# EAGLE design 1st_layer (EAGLE 9.6.2)
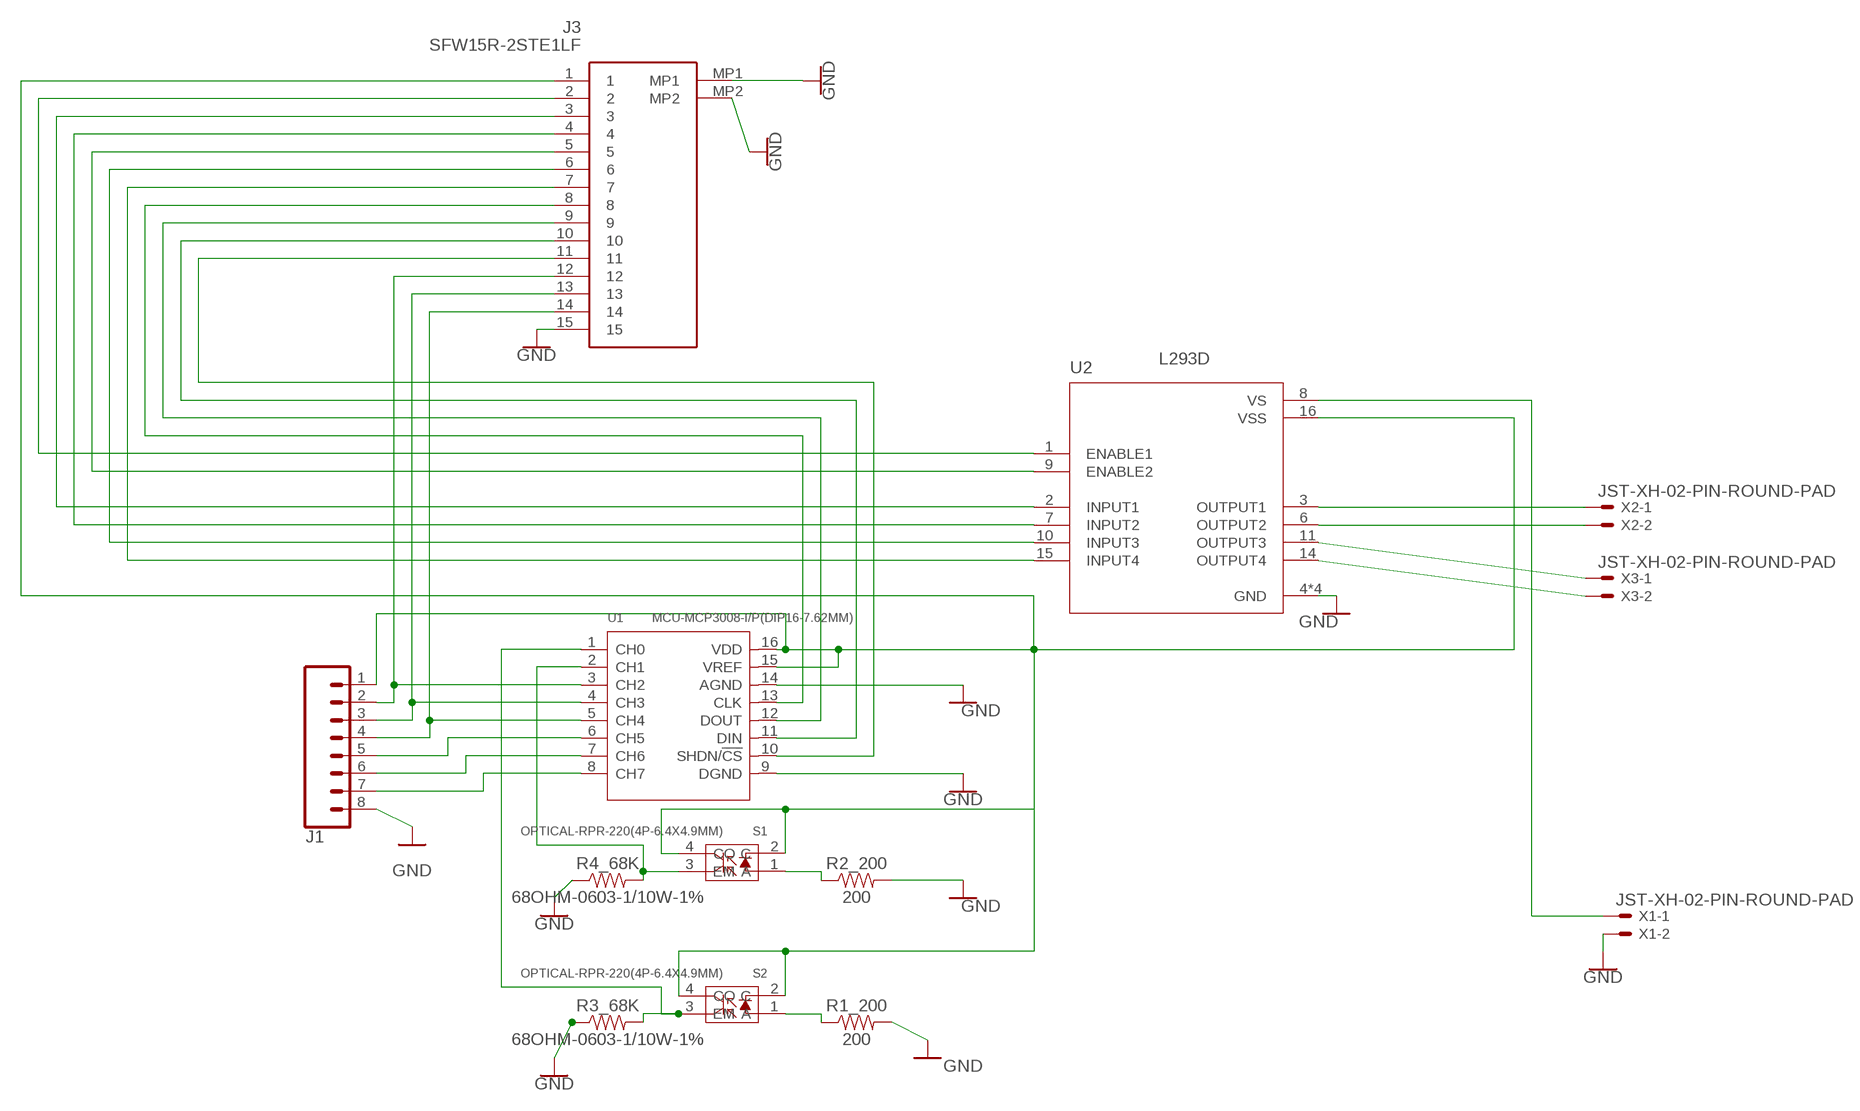
[diagram p0: schematic, sheet 1]

## Parts
J1  CONN_08LONGPADS  [1X08_LONGPADS]
J3  SFW15R-2STE1LF  [SFW15R2STE1LF]
R1_200  200  200OHM-0603-1/10W-1%  [0603]
R2_200  200  200OHM-0603-1/10W-1%  [0603]
R3_68K  68OHM-0603-1/10W-1%  [0603]
R4_68K  68OHM-0603-1/10W-1%  [0603]
S1  OPTICAL-RPR-220(4P-6.4X4.9MM)  [SNR4-8.7X4.5X5.8MM]
S2  OPTICAL-RPR-220(4P-6.4X4.9MM)  [SNR4-8.7X4.5X5.8MM]
U1  MCU-MCP3008-I/P(DIP16-7.62MM)  [DIP16-2.54-19.2X7.62MM]
U2  L293D  [DIP880W50P254L2000H510Q16]
X1  JST-XH-02-PIN-ROUND-PAD  [JST-XH-02-PACKAGE-ROUND-PAD]
X2  JST-XH-02-PIN-ROUND-PAD  [JST-XH-02-PACKAGE-ROUND-PAD]
X3  JST-XH-02-PIN-ROUND-PAD  [JST-XH-02-PACKAGE-ROUND-PAD]

## Nets
GND: J1.8 J3.15 J3.MP1 J3.MP2 R1_200.2 R2_200.2 R3_68K.1 R4_68K.1 U1.9(DGND) U1.14(AGND) U2.4(GND) U2.5(GND) U2.12(GND) U2.13(GND) X1.2
N$1: R2_200.1 S1.1(A)
N$2: R1_200.1 S2.1(A)
N$3: U2.8(VS) X1.1
N$4: R4_68K.2 S1.3(EM) U1.2(CH1)
N$6: R3_68K.2 S2.3(EM) U1.1(CH0)
N$7: U2.3(OUTPUT1) X2.1
N$8: U2.6(OUTPUT2) X2.2
N$9: U2.11(OUTPUT3) X3.1
N$10: U2.14(OUTPUT4) X3.2
N$11: J1.2 J3.12 U1.3(CH2)
N$12: J3.3 U2.2(INPUT1)
N$13: J3.4 U2.7(INPUT2)
N$14: J3.5 U2.9(ENABLE2)
N$15: J3.2 U2.1(ENABLE1)
N$16: J3.6 U2.10(INPUT3)
N$17: J3.7 U2.15(INPUT4)
N$18: J3.8 U1.13(CLK)
N$19: J3.9 U1.12(DOUT)
N$20: J3.10 U1.11(DIN)
N$21: J3.11 U1.10(SHDN/!CS)
N$22: J1.3 J3.13 U1.4(CH3)
N$23: J1.4 J3.14 U1.5(CH4)
N$24: J1.5 U1.6(CH5)
N$25: J1.6 U1.7(CH6)
N$26: J1.7 U1.8(CH7)
VDD: J1.1 J3.1 S1.2(C) S1.4(CO) S2.2(C) S2.4(CO) U1.15(VREF) U1.16(VDD) U2.16(VSS)

## Library data of the parts
J1 = SparkFun-Connectors:CONN_08: Multi connection point. Often used as Generic Header-pin footprint for 0.1 inch spaced/style header connections On any of the 0.1 inch spaced packages, you can populate with these: Break Away Headers - Straight <https://www.sparkfun.com/products/116> (PRT-00116) Break Away Male Headers - Right Angle <https://www.sparkfun.com/products/553> (PRT-00553) Female Headers <https://www.sparkfun.com/products/115> (PRT-00115) Break Away Headers - Machine Pin <https://www.sparkfun.com/products/117> (PRT-00117) Break Away Female Headers - Swiss Machine Pin <https://www.sparkfun.com/products/743> (PRT-00743) Arduino Stackable Header - 8 Pin <https://www.sparkfun.com/products/9279> (PRT-09279) For SCREWTERMINALS and SPRING TERMINALS visit here: Screw Terimnals on SparkFun.com <https://www.sparkfun.com/search/results?term=Screw+Terminals> (5mm/3.5mm/2.54mm spacing) This device is also useful as a general connection point to wire up your design to another part of your project. Our various solder wires solder well into these plated through hole pads. Hook-Up Wire - Assortment (Stranded, 22 AWG) <https://www.sparkfun.com/products/11375> (PRT-11375) Hook-Up Wire - Assortment (Solid Core, 22 AWG) <https://www.sparkfun.com/products/11367> (PRT-11367) View the entire wire category on our website here <https://www.sparkfun.com/categories/141> Special notes: Molex polarized connector foot print use with SKU : PRT-08231 with associated crimp pins and housings. 1MM SMD Version SKU: PRT-10208 NOTES ON THE VARIANTS LOCK and LOCK_LONGPADS... This footprint was designed to help hold the alignment of a through-hole component (i.e. 6-pin header) while soldering it into place. You may notice that each hole has been shifted either up or down by 0.005 of an inch from it's more standard position (which is a perfectly straight line). This slight alteration caused the pins (the squares in the middle) to touch the edges of the holes. Because they are alternating, it causes a "brace" to hold the component in place. 0.005 has proven to be the perfect amount of "off-center" position when using our standard breakaway headers. Although looks a little odd when you look at the bare footprint, once you have a header in there, the alteration is very hard to notice. Also,if you push a header all the way into place, it is covered up entirely on the bottom side.
J3 = SFW15R-2STE1LF:SFW15R-2STE1LF: FFC & FPC Connectors 15P SIDE SMT ZIF UPPER CONTACT Source: Datasheet <https://cdn.amphenol-icc.com/media/wysiwyg/files/drawing/sfw12lf.pdf>; DESCRIPTION: FFC & FPC Connectors 15P SIDE SMT ZIF UPPER CONTACT; HEIGHT: 2.7mm; MANUFACTURER_NAME: Amphenol; MANUFACTURER_PART_NUMBER: SFW15R-2STE1LF
R1_200 R2_200 = SparkFun-Resistors:200OHM: 200Ω resistor A resistor is a passive two-terminal electrical component that implements electrical resistance as a circuit element. Resistors act to reduce current flow, and, at the same time, act to lower voltage levels within circuits. - Wikipedia; PROD_ID: RES-08220
R3_68K R4_68K = SparkFun-Resistors:68OHM: 68Ω resistor A resistor is a passive two-terminal electrical component that implements electrical resistance as a circuit element. Resistors act to reduce current flow, and, at the same time, act to lower voltage levels within circuits. - Wikipedia
S1 S2 = OPTICAL-RPR-220_4P-6.4X4.9MM_:OPTICAL-RPR-220(4P-6.4X4.9MM): 314020002; DESCRIPTION: Reflective Optical Sensor 0.236 _6mm_ Radial - 4 Leads; DIGI-KEY_PART_NUMBER: 511-1366-ND; DIGI-KEY_PURCHASE_URL: https://www.digikey.com/product-detail/en/rohm-semiconductor/RPR-220/511-1366-ND/638554?utm_source=snapeda&utm_medium=aggregator&utm_campaign=symbol; MF: Rohm; MP: RPR-220; PACKAGE: Radial-4 Rohm
U1 = MCU-MCP3008-I_P_DIP16-7.62MM_:MCU-MCP3008-I/P(DIP16-7.62MM): 310990040; AVAILABILITY: Unavailable; DESCRIPTION: 10 Bit Analog to Digital Converter 4, 8 Input 1 SAR 16-PDIP; MF: Microchip; MP: MCP3008-I/P; PACKAGE: DIP-16 Microchip; PRICE: None
U2 = L293D:L293D: 4-Channel Motor Driver 24V 16-Pin Power PDIP Tube; AVAILABILITY: Unavailable; DESCRIPTION: Bipolar Motor Driver Parallel 16-PowerDIP; MF: STMicroelectronics; MP: L293D; PACKAGE: DIP-16 STMicroelectronics; PRICE: None
X1-X3 = Rembrandt Electronics - JST XH Connectors v1-0:JST-XH-02-PIN: JST XH Connector 2 Pin Wire to board connector. Pitch: 2,54 mm, (0.100") Number of pins: 2 Created by Rembrandt Electronics www.rembrandtelectronics.com

## Board
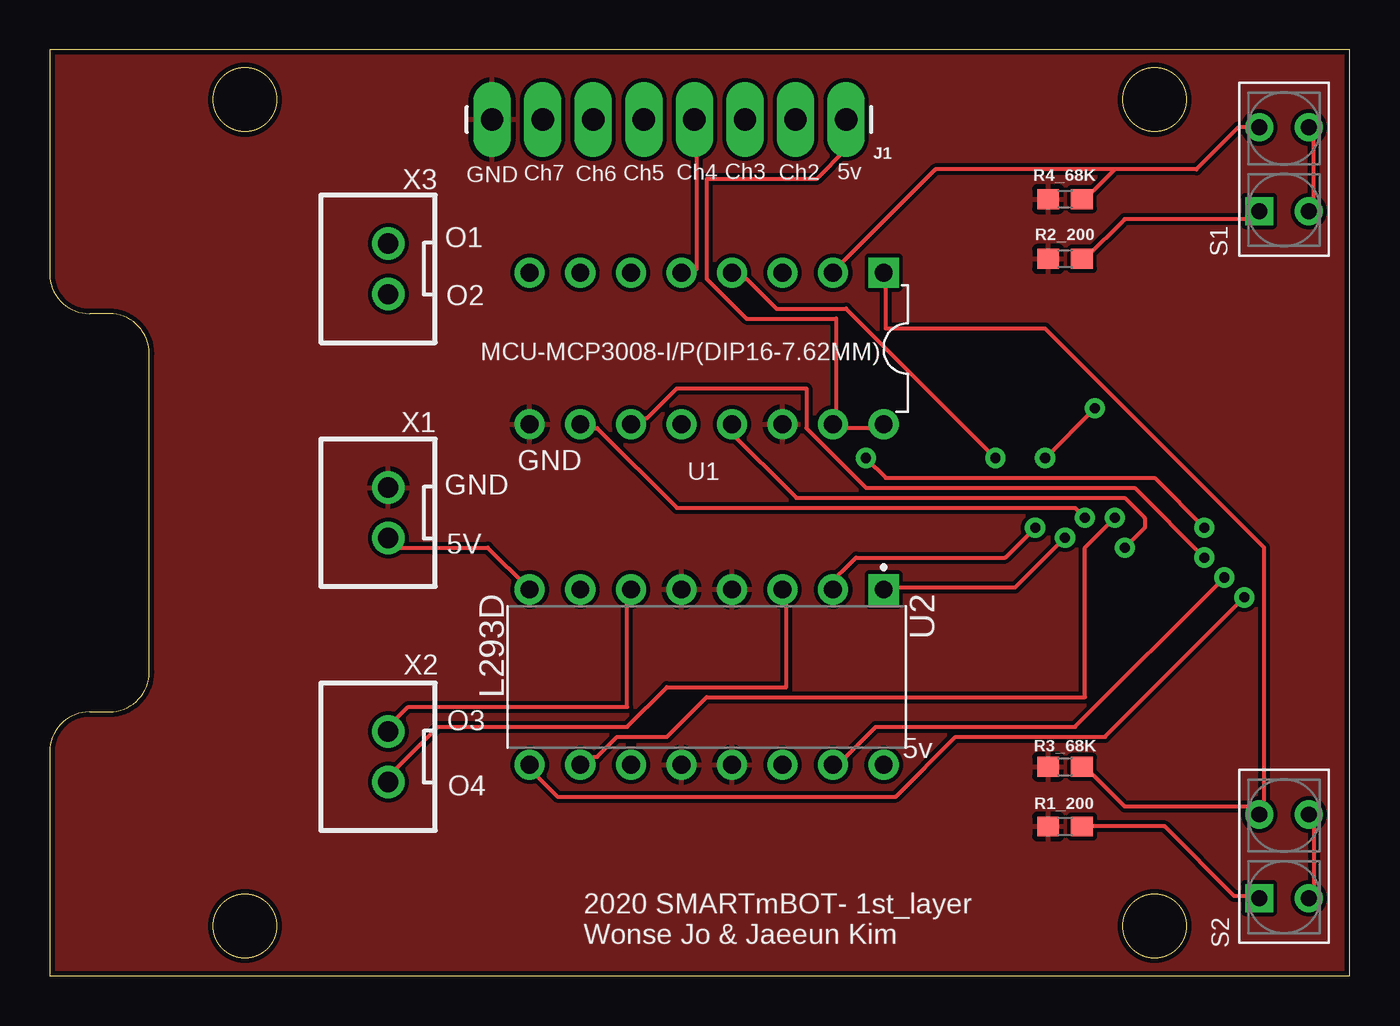
[diagram p1: board, top side]
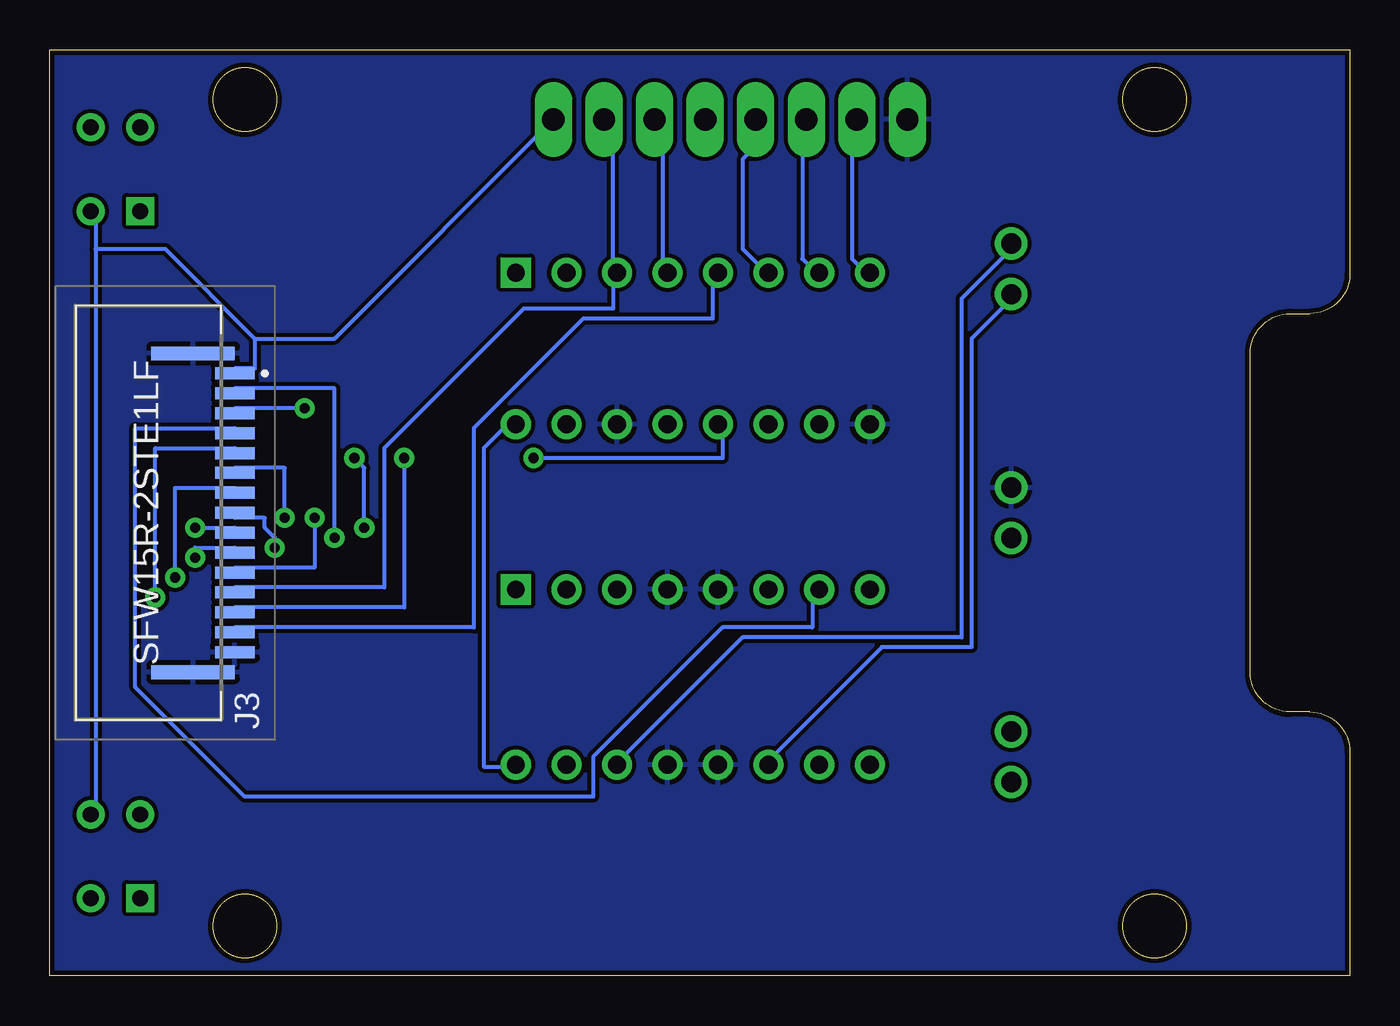
[diagram p2: board, bottom side, seen from below]

Size 65.3 x 46.5 mm. Coordinates in mm from the lower left corner, seen from the top.
Outline: 3,13.25 arc90 5,15.25 5,31.25 arc90 3,33.25 2,33.25 arc-90 0,35.25 0,46.5 65.3,46.5 65.3,0 0,0 0,11.25 arc-90 2,13.25 3,13.25
Outline: circle at 55.5,2.5 radius 1.6
Outline: circle at 55.5,44 radius 1.6
Outline: circle at 9.8,44 radius 1.6
Outline: circle at 9.8,2.5 radius 1.6
Copper layers (1*16): Top 0.035mm / dielectric 1.5mm / Bottom 0.035mm
Design rules "SparkFun": minimum track width 8mil, minimum drill 20mil, track to track 8mil, track to pad 8mil, pad to pad 8mil, via to via 8mil, smd to smd 8mil, copper to edge 10mil, drill to drill 8mil, minimum pad ring 12mil, minimum via ring 10mil, stop-mask expansion 4mil, vias tented up to drill 25mil, thermal gap 10mil

### Footprints (pad centres in the part's own frame; a part is rotated, then mirrored left to right if it is on the bottom)
1X08_LONGPADS = drill 1.118 pad 1.88 long: 1 0,0; 2 2.54,0; 3 5.08,0; 4 7.62,0; 5 10.16,0; 6 12.7,0; 7 15.24,0; 8 17.78,0
SFW15R2STE1LF = smd 0.6 x 2: 1 -7,4; 2 -6,4; 3 -5,4; 4 -4,4; 5 -3,4; 6 -2,4; 7 -1,4; 8 0,4; 9 1,4; 10 2,4; 11 3,4; 12 4,4; 13 5,4; 14 6,4; 15 7,4 | smd 0.7 x 4.2: MP1 -8,1.9; MP2 8,1.9
0603 = smd 1.1 x 1: 1 -0.85,0; 2 0.85,0
SNR4-8.7X4.5X5.8MM = drill 0.8 pad 1.35 square: 1 -2.1,1.25 | drill 0.8 pad 1.35: 2 -2.1,-1.25; 3 2.1,1.25; 4 2.1,-1.25
DIP16-2.54-19.2X7.62MM = drill 0.9 pad 1.4 square: 1 -8.89,-3.81 | drill 0.9 pad 1.4: 2 -6.35,-3.81; 3 -3.81,-3.81; 4 -1.27,-3.81; 5 1.27,-3.81; 6 3.81,-3.81; 7 6.35,-3.81; 8 8.89,-3.81; 9 8.89,3.81; 10 6.35,3.81; 11 3.81,3.81; 12 1.27,3.81; 13 -1.27,3.81; 14 -3.81,3.81; 15 -6.35,3.81; 16 -8.89,3.81
DIP880W50P254L2000H510Q16 = drill 0.9 pad 1.25 square: 1 -4.4,8.89 | drill 0.9 pad 1.25: 2 -4.4,6.35; 3 -4.4,3.81; 4 -4.4,1.27; 5 -4.4,-1.27; 6 -4.4,-3.81; 7 -4.4,-6.35; 8 -4.4,-8.89; 9 4.4,-8.89; 10 4.4,-6.35; 11 4.4,-3.81; 12 4.4,-1.27; 13 4.4,1.27; 14 4.4,3.81; 15 4.4,6.35; 16 4.4,8.89
JST-XH-02-PACKAGE-ROUND-PAD = drill 1.016: 1 -1.27,0; 2 1.27,0

### Placement (x,y rotation side)
J1  40,43 180 top
J3  60,23.25 270 bottom
R1_200  51,7.5 180 top
R2_200  51,36 180 top
R3_68K  51,10.5 0 top
R4_68K  51,39 0 top
S1  62,40.5 90 top
S2  62,6 90 top
U1  33,31.5 180 top
U2  33,15 270 top
X1  17,23.25 90 top
X2  17,11 90 top
X3  17,35.5 90 top

### Tracks (layer width: path | path; a pad name or v marks a point on that pad's centre or on a via)
GND
  pour Top: 65.3,0 0,0 0,11.25 arc-90 2,13.25 3,13.25 arc90 5,15.25 5,31.25 arc90 3,33.25 2,33.25 arc-90 0,35.25 0,46.5 65.3,46.5
  pour Bottom: 65.3,0 0,0 0,11.25 arc-90 2,13.25 3,13.25 arc90 5,15.25 5,31.25 arc90 3,33.25 2,33.25 arc-90 0,35.25 0,46.5 65.3,46.5
N$1
  Top 0.203: R2_200.1 52,36 54,38 60.5,38 S1.1
N$2
  Top 0.203: R1_200.1 56,7.5 59.5,4 60.5,4 S2.1
N$3
  Top 0.203: U2.8 24,19.5 22,21.5 17,21.5 X1.1
N$4
  Top 0.203: 53.5,40.5 52,39 R4_68K.2 | 53.5,40.5 57.6,40.5 59.7,42.6 S1.3 | 53.5,40.5 44.5,40.5 39.5,35.5 U1.2
N$6
  Top 0.203: R3_68K.2 52,10.5 54,8.5 60.5,8.5 S2.3 61,8.5 61,21.5 50,32.5 42,32.5 42,35 U1.1
N$7
  Top 0.203: U2.3 37,19 37,14.5 31,14.5 29,12.5 19.5,12.5 17,10 X2.1
N$8
  Top 0.203: U2.6 29,19 29,13.5 18,13.5 17,12.5 X2.2
N$9
  Bottom 0.203: U2.11 29,11 23.5,16.5 19,16.5 19,32 17,34 X3.1
N$10
  Bottom 0.203: U2.14 36.5,11 30.5,17 19.5,17 19.5,34 17,36.5 X3.2
N$11
  Bottom 0.203: J3.12 56,19.5 48.5,19.5 48.5,26.5 41.5,33.5 37,33.5 37,35 U1.3 37,35.5 37,43 J1.2
N$12  (via drill 0.51)
  Top 0.203: v50,26 v52.5,28.5 | v49.5,22.5 48,21 40.5,21 39,19.5 U2.2
  Bottom 0.203: v52.5,28.5 56,28.5 J3.3 | v50,26 49.5,25.5 v49.5,22.5
N$13
  Bottom 0.203: J3.4 56,27.5 61,27.5 61,14.5 55.5,9 38,9 38,11 31.5,17.5 27,17.5 27,19 U2.7
N$14  (via drill 0.51)
  Top 0.203: v60,19 53,12 45.5,12 42.5,9 25.5,9 24,10.5 U2.9
  Bottom 0.203: v60,19 60,26.5 56,26.5 J3.5
N$15  (via drill 0.51)
  Top 0.203: v51,22 48.5,19.5 42,19.5 U2.1
  Bottom 0.203: v51,22 51,29.5 56,29.5 J3.2
N$16  (via drill 0.51)
  Top 0.203: v53.5,23 52,21.5 52,14 33,14 31,12 28.5,12 27.5,11 27,11 U2.10
  Bottom 0.203: v53.5,23 53.5,25.5 56,25.5 J3.6
N$17  (via drill 0.51)
  Top 0.203: v59,20 51.5,12.5 41.5,12.5 40,11 39.5,11 U2.15
  Bottom 0.203: v59,20 59,24.5 56,24.5 J3.7
N$18  (via drill 0.51)
  Top 0.203: v54,21.5 55,22.5 55,23 54,24 37.5,24 34,27.5 U1.13
  Bottom 0.203: v54,21.5 54,22 54.5,22.5 54.5,23 56,23 J3.8
N$19  (via drill 0.51)
  Top 0.203: v58,22.5 55.5,25 42,25 v41,26
  Bottom 0.203: v58,22.5 56,22.5 J3.9 | v41,26 31.5,26 31.5,27.5 U1.12
N$20  (via drill 0.51)
  Top 0.203: v58,21 54.5,24.5 41,24.5 38,27.5 38,29.5 31.5,29.5 30,28 29.5,28 U1.11
  Bottom 0.203: v58,21 58,21.5 56,21.5 J3.10
N$21  (via drill 0.51)
  Top 0.203: v52,23 51.5,23.5 31.5,23.5 27.5,27.5 27,27.5 U1.10
  Bottom 0.203: v52,23 52,20.5 56,20.5 J3.11
N$22  (via drill 0.51)
  Top 0.203: v47.5,26 40,33.5 36.5,33.5 35,35 34.5,35 U1.4
  Bottom 0.203: v47.5,26 47.5,18.5 56,18.5 J3.13 | J1.3 34.5,43 34.5,35.5 U1.4
N$23
  Top 0.203: J1.4 32.5,43 32.5,35.5 32,35.5 U1.5
  Bottom 0.203: J3.14 56,17.5 44,17.5 44,27.5 38.5,33 32,33 32,35 U1.5
N$24
  Bottom 0.203: U1.6 29.5,35.5 30.5,36.5 30.5,41 30,41.5 30,43 J1.5
N$25
  Bottom 0.203: U1.7 27,35.5 27.5,36 27.5,43 J1.6
N$26
  Bottom 0.203: U1.8 24.5,35.5 25,36 25,43 J1.7
VDD
  Top 0.203: U1.16 41.5,27.5 39.5,27.5 U1.15 39.5,28 39.5,33 35,33 33,35 33,40 38.5,40 40,41.5 J1.1 | S2.2 63.5,4 63.5,8 S2.4 | S1.4 63.5,42.5 63.5,38.5 S1.2
  Bottom 0.203: U2.16 42,10.5 43.5,10.5 43.5,26.5 42,28 U1.16 | 55,32 55,30.5 56,30.5 J3.1 | 55,32 59.5,36.5 63,36.5 | 63,36.5 63,38 S1.2 | J1.1 51,32 55,32 | 63,36.5 63,8.5 S2.4

### Text on the board
tPlace: GND | Ch7 | Ch6 | Ch5 | Ch4 | Ch3 | Ch2 | 5v | O1 | O2 | GND | GND | 5V | O3 | 5v | O4 | 2020 SMARTmBOT- 1st_layer / Wonse Jo & Jaeeun Kim